# Altium schematic sheet 00_Diagram.SchDoc: Block Diagram
size A4; Project_Name: Monitoring_Control_Circuit; Designer: Hao Thai; Version: 1.0
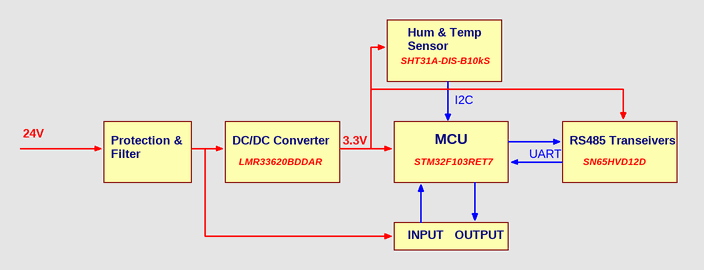
[diagram p0: 00_Diagram.SchDoc]

## Notes on the sheet
- Hum & Temp
- SHT31A-DIS-B10kS
- Sensor
- I2C
- 24V
- Protection &
- Filter
- DC/DC Converter
- LMR33620BDDAR
- 3.3V
- STM32F103RET7
- MCU
- UART
- RS485 Transeivers
- SN65HVD12D
- INPUT
- OUTPUT
- Document Title:
- Size:
- Project Name:
- A4
- Designer:
- Reviewer:
- Revision:
- Sheet
- of
- Nguyen Xien Street
- Long Thanh My Ward, Thu Duc District
- Ho Chi Minh City
- Date:
- File: